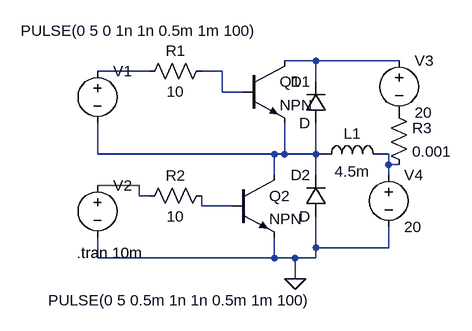
[diagram p0: schematic HalfWaveInverter_L.asc]
HalfWaveInverter_L.asc, the LTspice schematic file:
Version 4
SHEET 1 880 680
WIRE 464 160 416 160
WIRE 592 160 464 160
WIRE 208 176 128 176
WIRE 320 176 288 176
WIRE 464 192 464 160
WIRE 320 208 320 176
WIRE 352 208 320 208
WIRE 128 304 128 256
WIRE 400 304 128 304
WIRE 416 304 416 256
WIRE 416 304 400 304
WIRE 464 304 464 256
WIRE 464 304 416 304
WIRE 480 304 464 304
WIRE 576 304 560 304
WIRE 576 320 576 304
WIRE 592 320 576 320
WIRE 400 336 400 304
WIRE 464 336 464 304
WIRE 576 336 576 320
WIRE 192 352 128 352
WIRE 192 368 192 352
WIRE 208 368 192 368
WIRE 288 384 288 368
WIRE 336 384 288 384
WIRE 464 448 464 400
WIRE 576 448 576 416
WIRE 576 448 464 448
WIRE 128 464 128 432
WIRE 400 464 400 432
WIRE 400 464 128 464
WIRE 432 464 400 464
WIRE 464 464 464 448
WIRE 464 464 432 464
WIRE 432 496 432 464
FLAG 432 496 0
SYMBOL res 304 160 R90
WINDOW 0 0 56 VBottom 2
WINDOW 3 32 56 VTop 2
SYMATTR InstName R1
SYMATTR Value 10
SYMBOL voltage 128 160 R0
WINDOW 123 0 0 Left 0
WINDOW 39 0 0 Left 0
WINDOW 3 -118 -46 Left 2
SYMATTR InstName V1
SYMATTR Value PULSE(0 5 0 1n 1n 0.5m 1m 100)
SYMBOL voltage 592 144 R0
WINDOW 123 0 0 Left 0
WINDOW 39 0 0 Left 0
SYMATTR InstName V3
SYMATTR Value 20
SYMBOL voltage 576 320 R0
WINDOW 123 0 0 Left 0
WINDOW 39 0 0 Left 0
SYMATTR InstName V4
SYMATTR Value 20
SYMBOL npn 352 160 R0
SYMATTR InstName Q1
SYMBOL diode 480 256 R180
WINDOW 0 24 64 Left 2
WINDOW 3 24 0 Left 2
SYMATTR InstName D1
SYMBOL ind 464 320 R270
WINDOW 0 32 56 VTop 2
WINDOW 3 5 56 VBottom 2
SYMATTR InstName L1
SYMATTR Value 4.5m
SYMBOL diode 480 400 R180
WINDOW 0 24 64 Left 2
WINDOW 3 24 0 Left 2
SYMATTR InstName D2
SYMBOL npn 336 336 R0
SYMATTR InstName Q2
SYMBOL voltage 128 336 R0
WINDOW 3 -76 193 Left 2
SYMATTR InstName V2
SYMATTR Value PULSE(0 5 0.5m 1n 1n 0.5m 1m 100)
SYMBOL res 192 384 R270
WINDOW 0 32 56 VTop 2
WINDOW 3 0 56 VBottom 2
SYMATTR InstName R2
SYMATTR Value 10
SYMBOL res 576 224 R0
SYMATTR InstName R3
SYMATTR Value 0.001
TEXT 96 456 Left 2 !.tran 10m

The netlist it stands for:
* HalfWaveInverter_L.asc
R1 N003 N002 10
V1 N002 N004 PULSE(0 5 0 1n 1n 0.5m 1m 100)
V3 N001 P001 20
V4 N005 0 20
Q1 N001 N003 N004 0 NPN
D1 N004 N001 D
L1 N004 N005 4.5m
D2 0 N004 D
Q2 N004 N007 0 0 NPN
V2 N006 0 PULSE(0 5 0.5m 1n 1n 0.5m 1m 100)
R2 N006 N007 10
R3 P001 N005 0.001
.model D D
.lib standard.dio
.model NPN NPN
.model PNP PNP
.lib standard.bjt
.tran 10m
.backanno
.end